# EAGLE design and (EAGLE 9.6.2)
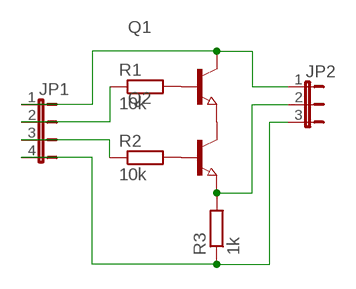
[diagram p0: schematic, sheet 1]

## Parts
JP1  JP4E  [JP4]
JP2  JP2W  [JP2W]
Q1  NPN-TRANSISTOR_SOT23  [SOT23]
Q2  NPN-TRANSISTOR_SOT23  [SOT23]
R1  10k  R-EU_R1206  [R1206]
R2  10k  R-EU_R1206  [R1206]
R3  1k  R-EU_R1206  [R1206]

## Nets
N$1: Q1.2(E) Q2.3(C)
N$2: Q1.1(B) R1.2
N$3: Q2.1(B) R2.2
N$4: JP2.2 Q2.2(E) R3.2
N$5: JP1.1 JP2.1 Q1.3(C)
N$6: JP1.2 R1.1
N$7: JP1.3 R2.1
N$8: JP1.4 JP2.3 R3.1

## Library data of the parts
JP1 = jumper:JP4E: JUMPER
JP2 = jumper:JP2W: JUMPER
Q1 Q2 = semicon-smd-ipc:NPN-TRANSISTOR_: NPN TRANSISTOR
R1-R3 = rcl:R-EU_: RESISTOR, European symbol; SPICEPREFIX: R

## Net classes
0 default: width 0.762 mm

## Board
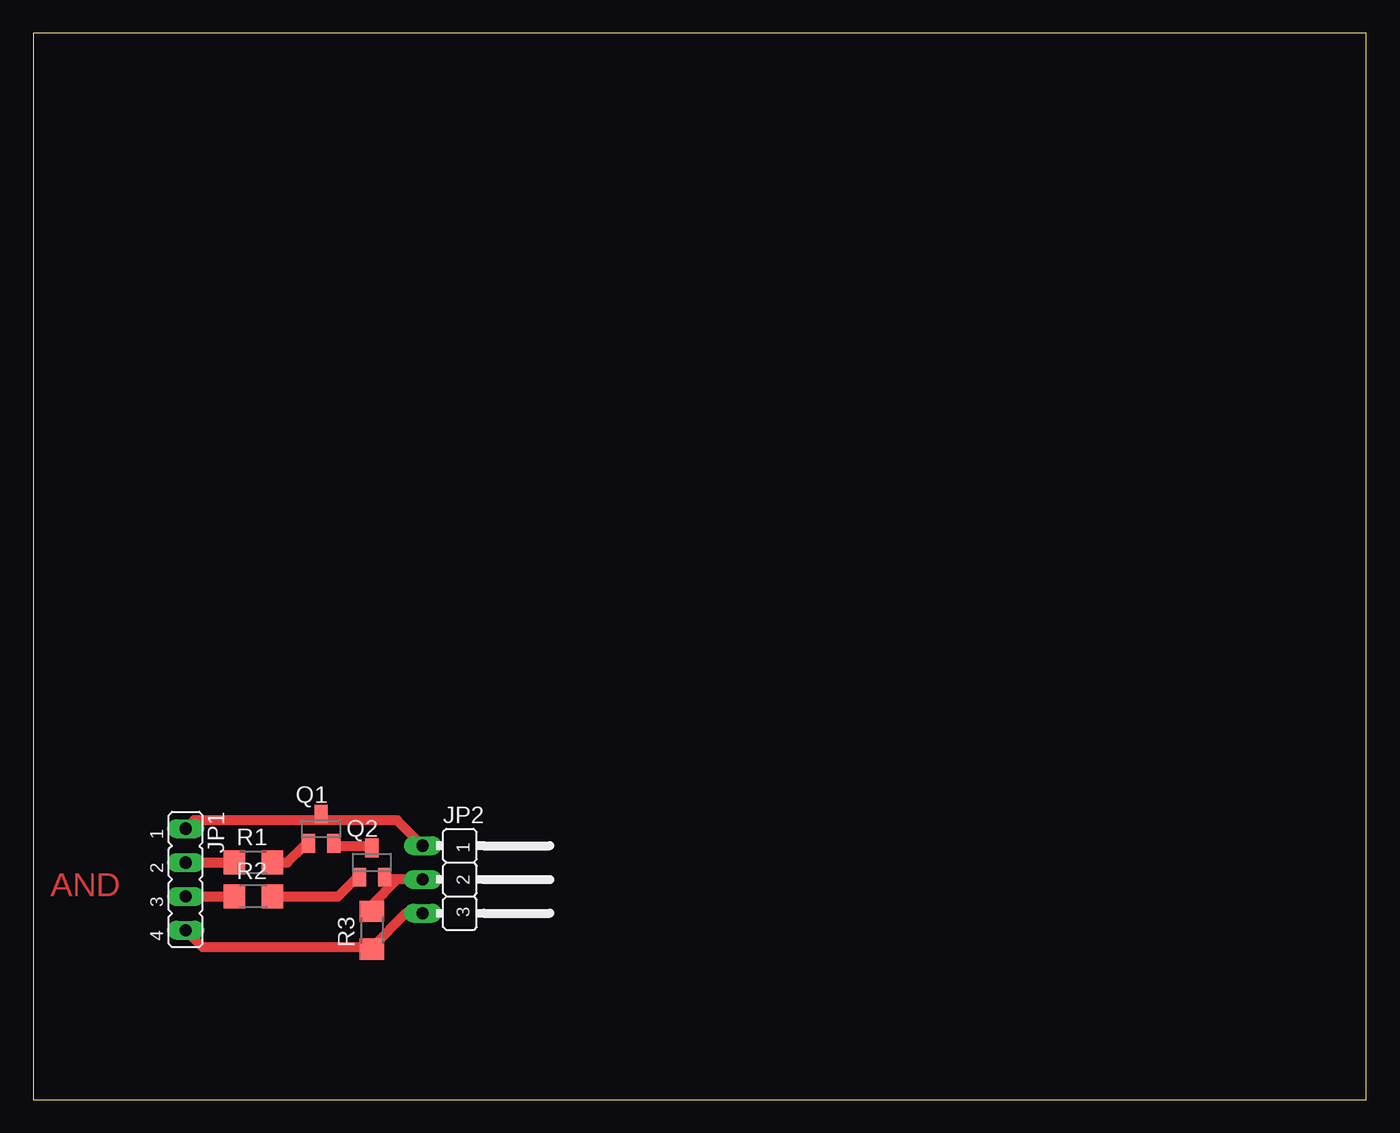
[diagram p1: board, top side]

Size 100 x 80 mm. Coordinates in mm from the lower left corner, seen from the top.
Outline: 0,0 100,0 100,80 0,80 0,0
Copper layers (1*16): Top 0.035mm / dielectric 1.5mm / Bottom 0.035mm
Design rules "default": minimum track width 6mil, minimum drill 0.35mm, track to track 6mil, track to pad 6mil, pad to pad 6mil, via to via 6mil, smd to smd 6mil, copper to edge 40mil, drill to drill 6mil, minimum pad ring 10mil, minimum via ring 8mil, stop-mask expansion 4mil, vias tented up to drill 0mil, thermal gap 10mil

### Footprints (pad centres in the part's own frame; a part is rotated, then mirrored left to right if it is on the bottom)
JP4 = drill 0.914 long: 1 -3.81,0; 2 -1.27,0; 3 1.27,0; 4 3.81,0
JP2W = drill 0.914 long: 1 -2.54,-1.27; 2 0,-1.27; 3 2.54,-1.27
SOT23 = smd 1 x 1.4: 1 -0.95,-1.1; 2 0.95,-1.1; 3 0,1.1
R1206 = smd 1.6 x 1.803: 1 -1.422,0; 2 1.422,0

### Placement (x,y rotation side)
JP1  11.43,16.51 270 top
JP2  30.48,16.51 270 top
Q1  21.59,20.32 0 top
Q2  25.4,17.78 0 top
R1  16.51,17.78 0 top
R2  16.51,15.24 0 top
R3  25.4,12.7 90 top

### Tracks (layer width: path | path; a pad name or v marks a point on that pad's centre or on a via)
N$1
  Top 0.762: Q2.3 25.4,19.05 22.86,19.05 Q1.2
N$2
  Top 0.762: R1.2 19.05,17.78 20.32,19.05 Q1.1
N$3
  Top 0.762: R2.2 22.86,15.24 24.13,16.51 Q2.1
N$4
  Top 0.762: JP2.2 27.3,16.51 | 27.3,16.51 26.67,16.51 Q2.2 | 27.3,16.51 25.4,14.61 R3.2
N$5
  Top 0.762: 21.59,20.95 27.3,20.95 JP2.1 | JP1.1 12.06,20.95 21.59,20.95 | 21.59,20.95 Q1.3
N$6
  Top 0.762: JP1.2 R1.1
N$7
  Top 0.762: JP1.3 R2.1
N$8
  Top 0.762: 25.4,11.43 27.94,13.97 JP2.3 | JP1.4 12.7,11.43 25.4,11.43 | 25.4,11.43 R3.1

### Text on the board
Top: AND